# EAGLE design 180 schematic 5 layer (EAGLE 9.6.2)
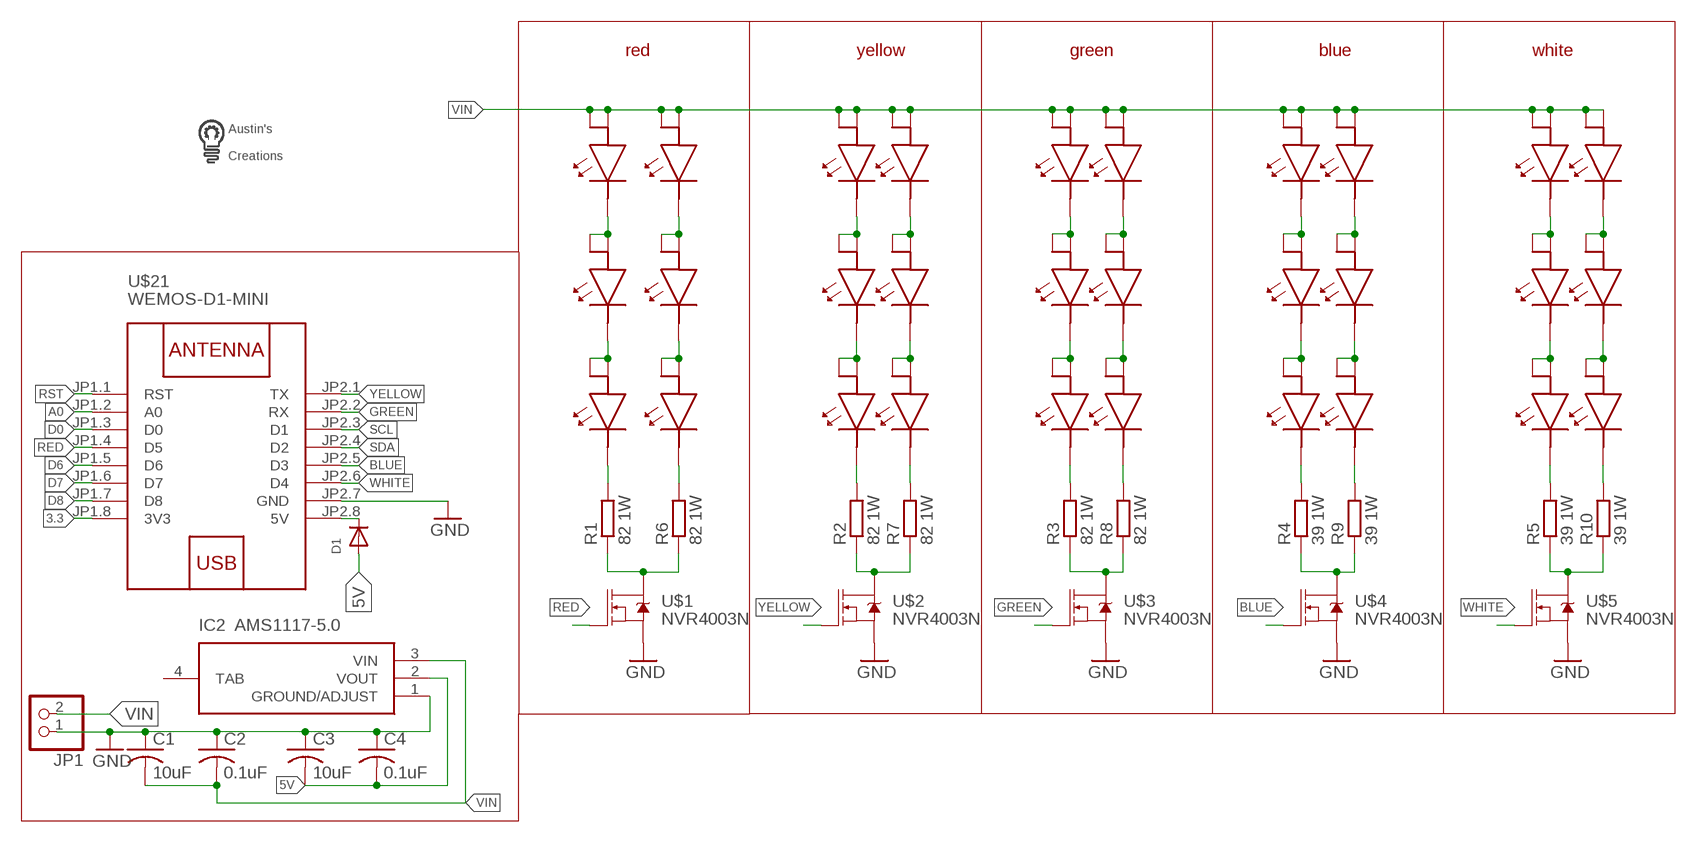
[diagram p0: schematic, sheet 1]

## Parts
C1  10uF  C-USC0603  [C0603]
C2  0.1uF  C-USC0603  [C0603]
C3  10uF  C-USC0603  [C0603]
C4  0.1uF  C-USC0603  [C0603]
D1  DIODESOD-123  [SOD-123]
IC2  AMS1117-5.0  [SOT229P700X180-4N]
JP1  PINHD-1X2  [1X02]
R1  82 1W  R-EU_R2010  [R2010]
R2  82 1W  R-EU_R2010  [R2010]
R3  82 1W  R-EU_R2010  [R2010]
R4  39 1W  R-EU_R2010  [R2010]
R5  39 1W  R-EU_R2010  [R2010]
R6  82 1W  R-EU_R2010  [R2010]
R7  82 1W  R-EU_R2010  [R2010]
R8  82 1W  R-EU_R2010  [R2010]
R9  39 1W  R-EU_R2010  [R2010]
R10  39 1W  R-EU_R2010  [R2010]
U$1  NVR4003N  [SOT23]
U$2  NVR4003N  [SOT23]
U$3  NVR4003N  [SOT23]
U$4  NVR4003N  [SOT23]
U$5  NVR4003N  [SOT23]
U$6  5730LED  [5730LED]
U$7  5730LED  [5730LED]
U$8  5730LED  [5730LED]
U$9  5730LED  [5730LED]
U$10  5730LED  [5730LED]
U$11  5730LED  [5730LED]
U$12  5730LED  [5730LED]
U$13  5730LED  [5730LED]
U$14  5730LED  [5730LED]
U$15  5730LED  [5730LED]
U$16  5730LED  [5730LED]
U$17  5730LED  [5730LED]
U$18  5730LED  [5730LED]
U$19  5730LED  [5730LED]
U$20  5730LED  [5730LED]
U$21  WEMOS-D1-MINI  [WEMOS-D1-MINI]
U$22  LOGO  [LOGO]
U$23  5730LED  [5730LED]
U$24  5730LED  [5730LED]
U$25  5730LED  [5730LED]
U$26  5730LED  [5730LED]
U$27  5730LED  [5730LED]
U$28  5730LED  [5730LED]
U$29  5730LED  [5730LED]
U$30  5730LED  [5730LED]
U$31  5730LED  [5730LED]
U$32  5730LED  [5730LED]
U$33  5730LED  [5730LED]
U$34  5730LED  [5730LED]
U$35  5730LED  [5730LED]
U$36  5730LED  [5730LED]
U$37  5730LED  [5730LED]

## Nets
3.3: U$21.JP1.8(3V3)
5V: C3.2 C4.2 D1.A IC2.2(VOUT)
A0: U$21.JP1.2(A0)
BLUE: U$4.2(G) U$21.JP2.5(D3)
D0: U$21.JP1.3(D0)
D6: U$21.JP1.5(D6)
D7: U$21.JP1.6(D7)
D8: U$21.JP1.7(D8)
GND: C1.1 C2.1 C3.1 C4.1 IC2.1(GROUND/ADJUST) JP1.1 U$1.3(S) U$2.3(S) U$3.3(S) U$4.3(S) U$5.3(S) U$21.JP2.7(GND)
GREEN: U$3.2(G) U$21.JP2.2(RX)
N$1: D1.C U$21.JP2.8(5V)
N$2: U$6.P$2 U$7.P$1 U$7.P$3
N$3: U$9.P$2 U$10.P$1 U$10.P$3
N$4: R1.1 R6.1 U$1.1(D)
N$5: R2.1 R7.1 U$2.1(D)
N$6: U$12.P$2 U$13.P$1 U$13.P$3
N$7: U$15.P$2 U$16.P$1 U$16.P$3
N$8: U$18.P$2 U$19.P$1 U$19.P$3
N$9: U$7.P$2 U$8.P$1 U$8.P$3
N$10: R1.2 U$8.P$2
N$11: R2.2 U$11.P$2
N$12: R3.2 U$14.P$2
N$13: R4.2 U$17.P$2
N$14: R5.2 U$20.P$2
N$15: U$19.P$2 U$20.P$1 U$20.P$3
N$16: U$16.P$2 U$17.P$1 U$17.P$3
N$17: U$13.P$2 U$14.P$1 U$14.P$3
N$18: U$10.P$2 U$11.P$1 U$11.P$3
N$19: U$23.P$2 U$24.P$1 U$24.P$3
N$20: U$24.P$2 U$25.P$1 U$25.P$3
N$21: R3.1 R8.1 U$3.1(D)
N$22: R4.1 R9.1 U$4.1(D)
N$23: R5.1 R10.1 U$5.1(D)
N$24: R6.2 U$25.P$2
N$25: U$29.P$2 U$30.P$1 U$30.P$3
N$26: U$26.P$2 U$27.P$1 U$27.P$3
N$27: R7.2 U$28.P$2
N$28: U$27.P$2 U$28.P$1 U$28.P$3
N$29: R8.2 U$31.P$2
N$30: U$30.P$2 U$31.P$1 U$31.P$3
N$32: U$32.P$2 U$33.P$1 U$33.P$3
N$33: R9.2 U$34.P$2
N$34: U$33.P$2 U$34.P$1 U$34.P$3
N$36: U$35.P$2 U$36.P$1 U$36.P$3
N$37: R10.2 U$37.P$2
N$38: U$36.P$2 U$37.P$1 U$37.P$3
RED: U$1.2(G) U$21.JP1.4(D5)
RST: U$21.JP1.1(RST)
SCL: U$21.JP2.3(D1)
SDA: U$21.JP2.4(D2)
VIN: C1.2 C2.2 IC2.3(VIN) JP1.2 U$6.P$1 U$6.P$3 U$9.P$1 U$9.P$3 U$12.P$1 U$12.P$3 U$15.P$1 U$15.P$3 U$18.P$1 U$18.P$3 U$23.P$1 U$23.P$3 U$26.P$1 U$26.P$3 U$29.P$1 U$29.P$3 U$32.P$1 U$32.P$3 U$35.P$1 U$35.P$3
WHITE: U$5.2(G) U$21.JP2.6(D4)
YELLOW: U$2.2(G) U$21.JP2.1(TX)
Unconnected: IC2.4(TAB)

## Notes on the sheet
- red | yellow | green | blue | white

## Library data of the parts
C1-C4 = adafruit:C-US: CAPACITOR, American symbol
D1 = adafruit:DIODE: Diode SMADIODE - SMA Surface Mount Package 20V 1A Schottky Diode Digikey: 641-1014-6-ND DO-1N4148 - Through Hole Small Current Diode SOD-123 20V 1 A (.5mV Vf) Schottky Diode - Digikey: MBRX120TPMSCT-ND SOD-323 10V 570mA (.38mV Vf, 3ns) Schottky Diode - Digikey: ZLLS410CT-ND SOD-523 30V 30mA Schottky Diode (RB751S-40TE61) - Digikey: RB751S-40TE61CT-ND SOT23-R/W - SOT23 Package (R = Solder Paste/Reflow Ovens, W = Hand-Soldering) BAT54Film 40V 300mA - Digikey: 497-7162-1-ND
IC2 = SamacSys_Parts:AMS1117-5.0: 1A LOW DROPOUT VOLTAGE REGULATOR Source: Datasheet <http://www.advanced-monolithic.com/pdf/ds1117.pdf>; DESCRIPTION: 1A LOW DROPOUT VOLTAGE REGULATOR; HEIGHT: 1.8mm; MANUFACTURER_NAME: Advanced Monolithic Systems; MANUFACTURER_PART_NUMBER: AMS1117-5.0
JP1 = pinhead:PINHD-1X2: PIN HEADER
R1-R10 = rcl:R-EU_: RESISTOR, European symbol; SPICEPREFIX: R
U$1-U$5 = custom parts:NVR4003N
U$6-U$20 U$23-U$37 = custom parts:5730LED
U$21 = diy-modules:WEMOS-D1-MINI: WEMOS D1 mini: Mini Wi-Fi Board based on ESP-8266 device More details can be found here: https://www.wemos.cc/product/d1-mini.html Click here to find device on ebay.com <http://www.ebay.com/sch/wemos+d1+mini+nodemcu>
U$22 = custom parts:LOGO

## Board
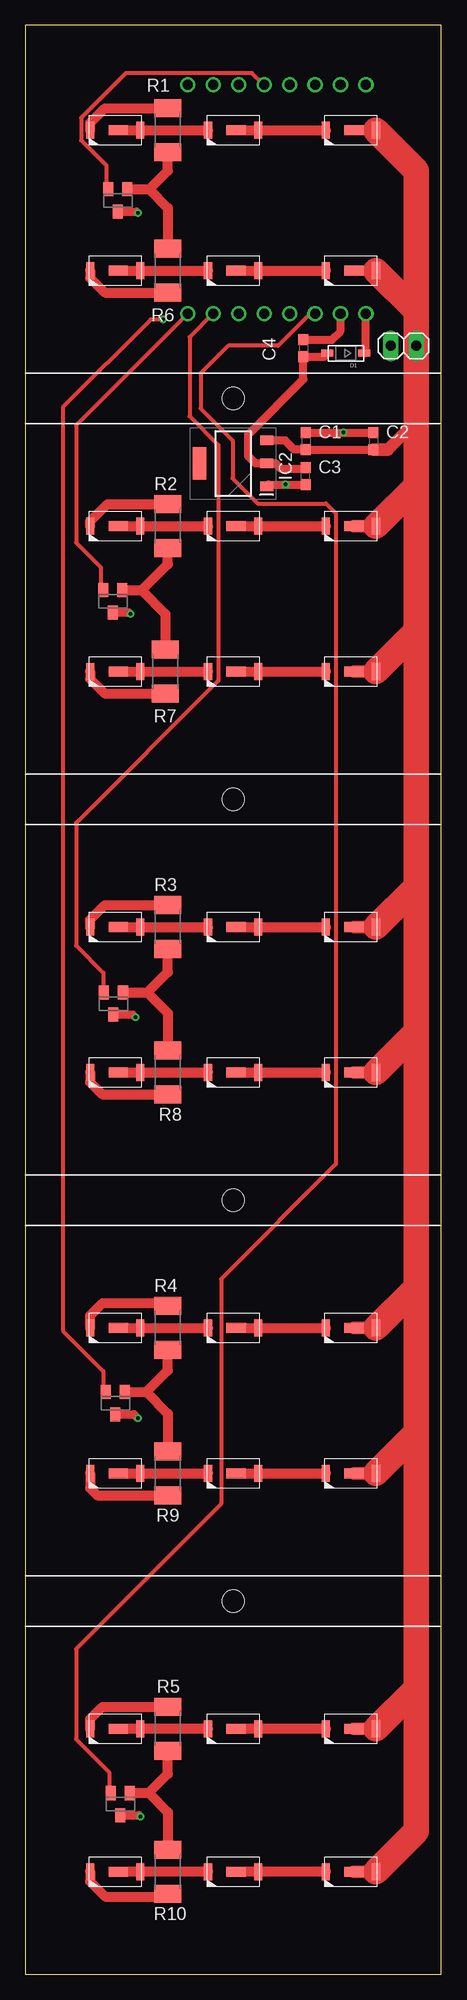
[diagram p1: board, top side]
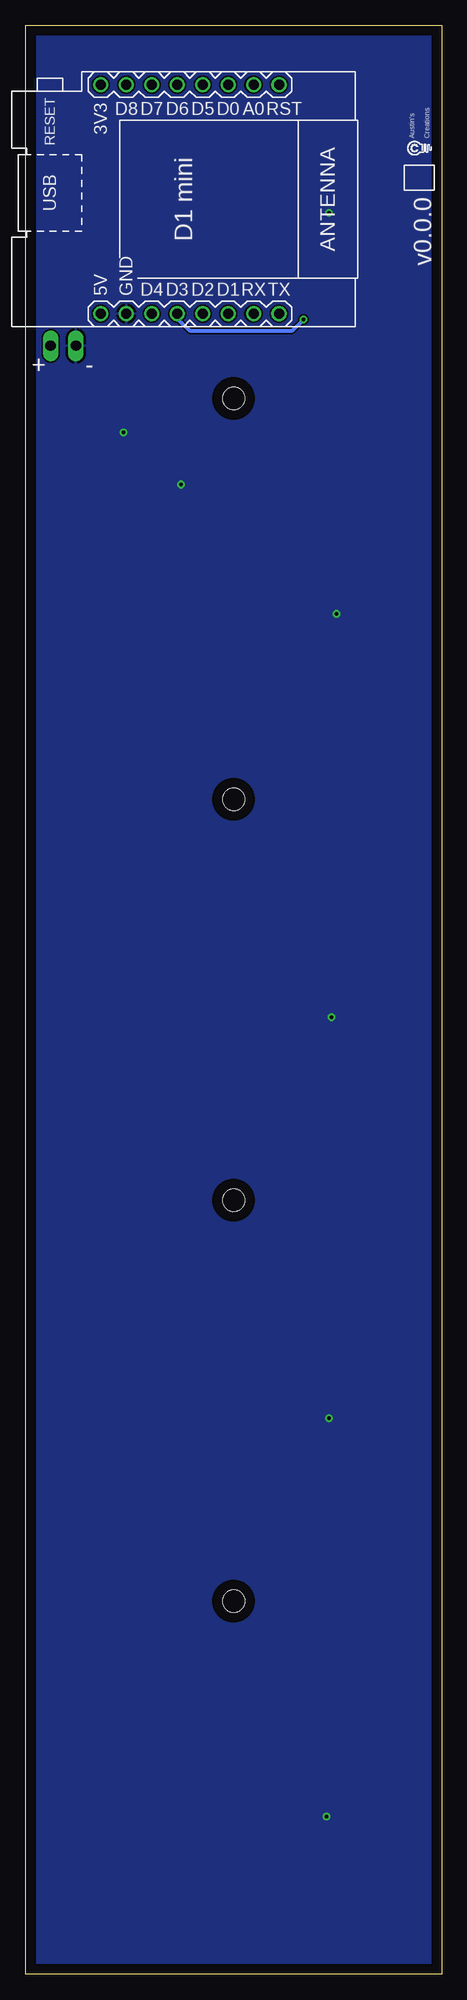
[diagram p2: board, bottom side, seen from below]

Size 41.5 x 194.5 mm. Coordinates in mm from the lower left corner, seen from the top.
Outline: 0,0 41.5,0 41.5,194.5 0,194.5 0,0
Copper layers (1*16): Top 0.035mm / dielectric 1.5mm / Bottom 0.035mm
Design rules "default *": minimum track width 16mil, minimum drill 0.35mm, track to track 6mil, track to pad 6mil, pad to pad 6mil, via to via 6mil, smd to smd 6mil, copper to edge 40mil, drill to drill 6mil, minimum pad ring 10mil, minimum via ring 8mil, stop-mask expansion 4mil, vias tented up to drill 0mil, thermal gap 10mil
Holes 2.2 mm at 20.75,157.25 20.75,117.25 20.75,77.25 20.75,37.25

### Footprints (pad centres in the part's own frame; a part is rotated, then mirrored left to right if it is on the bottom)
C0603 = smd 1.1 x 1: 1 -0.85,0; 2 0.85,0
SOD-123 = smd 1.2 x 0.7: A 1.85,0; C -1.85,0
SOT229P700X180-4N = smd 1.3 x 0.95: 1 -3.35,2.29; 2 -3.35,0; 3 -3.35,-2.29 | smd 1.3 x 3.25: 4 3.35,0
1X02 = drill 1.016 long: 1 -1.27,0; 2 1.27,0
R2010 = smd 1.8 x 2.7: 1 -2.2,0; 2 2.2,0
SOT23 = smd 1 x 1.4: 1 -0.95,-1.1; 2 0.95,-1.1; 3 0,1.1
5730LED = smd 0.813 x 1.676: P$1 -2.5,0; P$2 2.5,0 | smd 1.93 x 0.965: P$3 -0.3,0
WEMOS-D1-MINI = drill 1: JP1.1 -11.43,9.525; JP1.2 -11.43,6.985; JP1.3 -11.43,4.445; JP1.4 -11.43,1.905; JP1.5 -11.43,-0.635; JP1.6 -11.43,-3.175; JP1.7 -11.43,-5.715; JP1.8 -11.43,-8.255; JP2.1 11.43,9.525; JP2.2 11.43,6.985; JP2.3 11.43,4.445; JP2.4 11.43,1.905; JP2.5 11.43,-0.635; JP2.6 11.43,-3.175; JP2.7 11.43,-5.715; JP2.8 11.43,-8.255

### Placement (x,y rotation side)
C1  28,153 270 top
C2  34.75,153 270 top
C3  28,149.5 90 top
C4  27.75,162.25 270 top
D1  32,161.75 180 top
IC2  20.75,150.75 180 top
JP1  37.75,162.5 0 top
R1  14.25,184 90 top
R2  14.25,144.5 90 top
R3  14.25,104.5 90 top
R4  14.25,64.5 90 top
R5  14.25,24.5 90 top
R6  14.25,170 270 top
R7  14,130 270 top
R8  14.25,90 270 top
R9  14.25,50 270 top
R10  14.25,10.25 270 top
U$1  9.25,177 180 top
U$2  8.75,137 180 top
U$3  8.82,96.86 180 top
U$4  9,57 180 top
U$5  9.5,17 180 top
U$6  32.5,184 180 top
U$7  20.75,184 180 top
U$8  9,184 180 top
U$9  32.5,144.5 180 top
U$10  20.75,144.5 180 top
U$11  9,144.5 180 top
U$12  32.5,104.5 180 top
U$13  20.75,104.5 180 top
U$14  9,104.5 180 top
U$15  32.5,64.5 180 top
U$16  20.75,64.5 180 top
U$17  9,64.5 180 top
U$18  32.5,24.5 180 top
U$19  20.75,24.5 180 top
U$20  9,24.5 180 top
U$21  25.75,177.12 270 bottom
U$22  1,181.5 90 bottom
U$23  32.5,170 180 top
U$24  20.75,170 180 top
U$25  9,170 180 top
U$26  32.5,130 180 top
U$27  20.75,130 180 top
U$28  9,130 180 top
U$29  32.5,90 180 top
U$30  20.75,90 180 top
U$31  9,90 180 top
U$32  32.5,50 180 top
U$33  20.75,50 180 top
U$34  9,50 180 top
U$35  32.5,10.25 180 top
U$36  20.75,10.25 180 top
U$37  9,10.25 180 top

### Tracks (layer width: path | path; a pad name or v marks a point on that pad's centre or on a via)
5V
  Top 0.813: C3.2 27.9,150.25 25.5,150.25 25,150.75 IC2.2 23,150.75 22.25,151.5 22.25,153.65 27.75,159.15 C4.2 29.8,161.4 D1.A
BLUE  (via drill 0.35)
  Top 0.406: v13.78,165.12 12.53,165.12 3.78,156.38 3.78,64.23 7.82,60.19 7.82,58.12 U$4.2
  Bottom 0.406: v13.78,165.12 14.9,164.01 25.15,164.01 26.26,165.12 26.26,165.68 U$21.JP2.5
GND  (via drill 0.35)
  Top 0.813: C1.1 v31.75,153.85 C2.1 | IC2.1 24.29,148.65 v26,148.65 C3.1 | U$2.3 10.35,135.9 v10.5,135.75 | U$1.3 11.1,175.9 v11.25,175.75 | U$3.3 10.74,95.76 v11,95.5 | U$4.3 10.85,55.9 v11.25,55.5 | U$5.3 11.35,15.9 v11.5,15.75 | C4.1 30.6,163.1 31.46,163.97 U$21.JP2.7
  pour Bottom: 0,194.5 0,0 41.5,0 41.5,194.5
GREEN
  Top 0.406: U$3.2 7.82,98.07 7.82,99.92 5.09,102.66 5.09,114.89 19.28,129.08 19.28,152.6 16.41,155.46 16.41,163.38 18.72,165.68 U$21.JP2.2
N$1
  Top 0.813: D1.C 34.01,161.91 U$21.JP2.8
N$2
  Top 1.016: U$7.P$3 U$7.P$1 U$6.P$2
N$3
  Top 1.016: U$10.P$3 U$10.P$1 U$9.P$2
N$4
  Top 1.016: R6.1 14.25,176.25 12.4,178.1 | 12.4,178.1 14.25,179.95 R1.1 | U$1.1 12.4,178.1
N$5
  Top 1.016: R7.1 14,135.75 11.65,138.1 | 11.65,138.1 14.25,140.7 R2.1 | U$2.1 11.65,138.1
N$6
  Top 1.016: U$13.P$3 U$13.P$1 U$12.P$2
N$7
  Top 1.016: U$16.P$3 U$16.P$1 U$15.P$2
N$8
  Top 1.016: U$18.P$2 U$19.P$1 U$19.P$3
N$9
  Top 1.016: U$8.P$3 U$8.P$1 U$7.P$2
N$10
  Top 1.016: U$8.P$2 6.5,184.75 7.95,186.2 R1.2
N$11
  Top 1.016: U$11.P$2 6.5,145 8.2,146.7 R2.2
N$12
  Top 1.016: U$14.P$2 6.5,105.25 7.95,106.7 R3.2
N$13
  Top 1.016: U$17.P$2 6.5,65.75 7.75,67 13.95,67 R4.2
N$14
  Top 1.016: U$20.P$2 6.5,25.5 7.7,26.7 R5.2
N$15
  Top 1.016: U$19.P$2 U$20.P$1 U$20.P$3
N$16
  Top 1.016: U$17.P$3 U$17.P$1 U$16.P$2
N$17
  Top 1.016: U$14.P$3 U$14.P$1 U$13.P$2
N$18
  Top 1.016: U$11.P$3 U$11.P$1 U$10.P$2
N$19
  Top 1.016: U$24.P$3 U$24.P$1 U$23.P$2
N$20
  Top 1.016: U$25.P$3 U$25.P$1 U$24.P$2
N$21
  Top 1.016: U$3.1 12.21,97.96 | R3.1 14.25,100 12.21,97.96 | 12.21,97.96 14.25,95.92 R8.1
N$22
  Top 1.016: U$4.1 12.1,58.1 | R4.1 14.25,60.25 12.1,58.1 | 12.1,58.1 14.25,55.95 R9.1
N$23
  Top 1.016: U$5.1 12.35,18.1 | R5.1 14.25,20 12.35,18.1 | 12.35,18.1 14.25,16.2 R10.1
N$24
  Top 1.016: U$25.P$2 6.5,169.25 7.95,167.8 R6.2
N$25
  Top 1.016: U$30.P$3 U$30.P$1 U$29.P$2
N$26
  Top 1.016: U$27.P$3 U$27.P$1 U$26.P$2
N$27
  Top 1.016: U$28.P$2 6.5,129.25 7.95,127.8 R7.2
N$28
  Top 1.016: U$28.P$3 U$28.P$1 U$27.P$2
N$29
  Top 1.016: U$31.P$2 6.5,89 7.7,87.8 R8.2
N$30
  Top 1.016: U$31.P$3 U$31.P$1 U$30.P$2
N$32
  Top 1.016: U$33.P$3 U$33.P$1 U$32.P$2
N$33
  Top 1.016: U$34.P$2 6.5,48.5 7.2,47.8 R9.2
N$34
  Top 1.016: U$34.P$3 U$34.P$1 U$33.P$2
N$36
  Top 1.016: U$35.P$2 U$36.P$1 U$36.P$3
N$37
  Top 1.016: U$37.P$2 6.5,9.25 8,7.75 13.95,7.75 R10.2
N$38
  Top 1.016: U$36.P$2 U$37.P$1 U$37.P$3
RED
  Top 0.406: U$1.2 8.1,178.26 8.1,180.49 5.59,183.01 5.59,185.24 10.06,189.71 22.63,189.71 23.75,188.59 U$21.JP1.4
VIN
  Top 0.813: C2.2 C1.2 26.85,152.15 25.96,153.04 IC2.3
  Top 1.016: U$23.P$3 U$23.P$1 | U$6.P$3 U$6.P$1
  Top 1.27: C2.2 36.17,152.15 39.02,155 | U$35.P$3 U$35.P$1 | U$18.P$3 U$18.P$1 | U$32.P$3 U$32.P$1 | U$15.P$3 U$15.P$1 | U$29.P$3 U$29.P$1 | U$12.P$3 U$12.P$1 | U$26.P$3 U$26.P$1 | U$9.P$3 U$9.P$1
  Top 2.54: 39.02,165.98 JP1.2 39.02,155 39.02,148.52 | 39.02,165.98 U$23.P$1 | 39.02,165.98 39.02,179.98 U$6.P$1 | 39.02,148.52 U$9.P$1 | 39.02,148.52 39.02,134.02 | 39.02,134.02 U$26.P$1 | 39.02,134.02 39.02,108.52 | 39.02,108.52 U$12.P$1 | 39.02,108.52 39.02,94.02 | 39.02,94.02 U$29.P$1 | 39.02,94.02 39.02,68.52 | 39.02,68.52 U$15.P$1 | 39.02,68.52 39.02,54.02 | 39.02,54.02 U$32.P$1 | 39.02,54.02 39.02,28.52 | U$18.P$1 39.02,28.52 | 39.02,28.52 39.02,14.27 U$35.P$1
WHITE
  Top 0.406: U$5.2 8.38,18.16 8.38,20.18 5.09,23.47 5.09,32.48 19.56,46.95 19.56,69.39 31.01,80.85 31.01,145.79 30.03,146.77 23.19,146.77 20.7,149.26 20.7,153.04 17.5,156.25 17.5,159.75 20.25,162.5 25.25,162.5 28.45,165.69 U$21.JP2.6
YELLOW
  Top 0.406: U$2.2 7.54,138.3 7.54,140.41 5.09,142.86 5.09,154.57 16.2,165.68 U$21.JP2.1

### Text on the board
bPlace: - | +
bNames: v0.0.0